# EAGLE design Side (EAGLE 9.1.3)
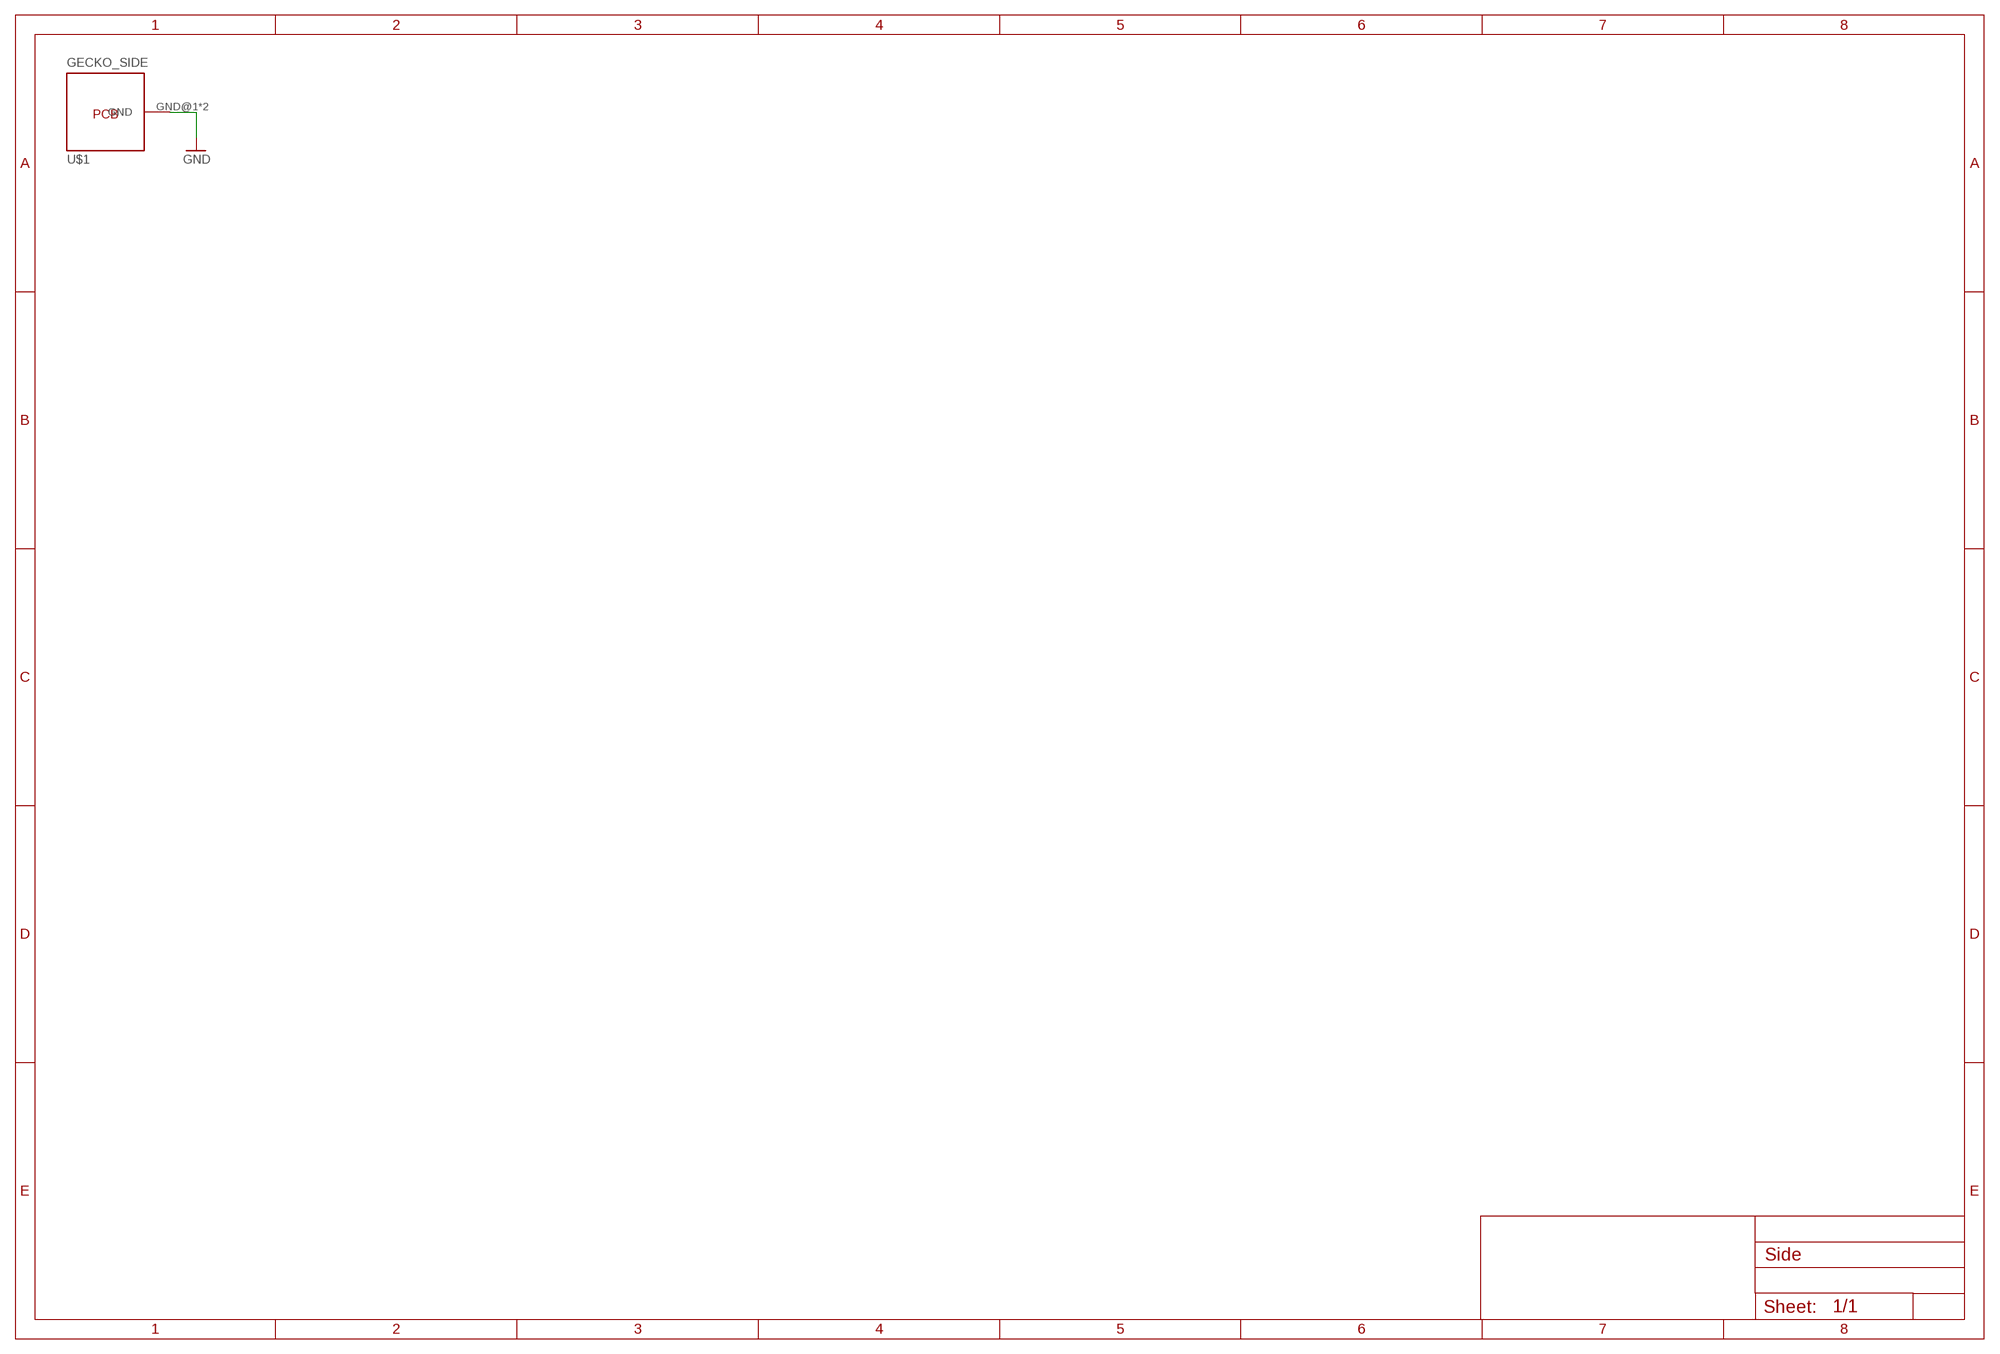
[diagram p0: schematic, sheet 1]

## Parts
U$1  GECKO_SIDE  [GECKO_SIDE]

## Nets
GND: U$1.GND@1(GND) U$1.GND@2(GND)

## Library data of the parts
U$1 = MyLib:GECKO_SIDE

## Board
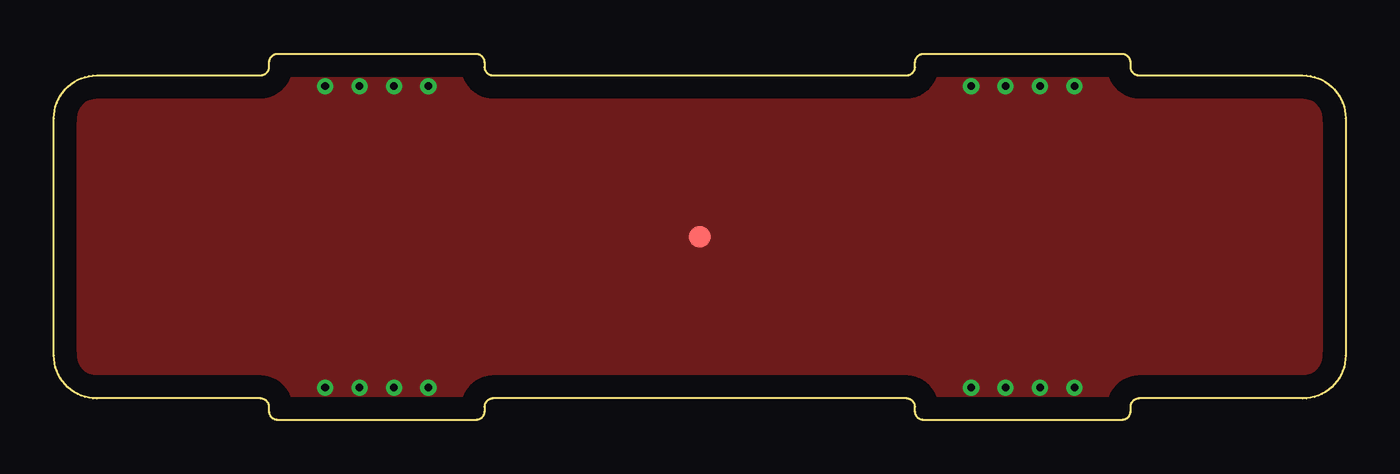
[diagram p1: board, top side]
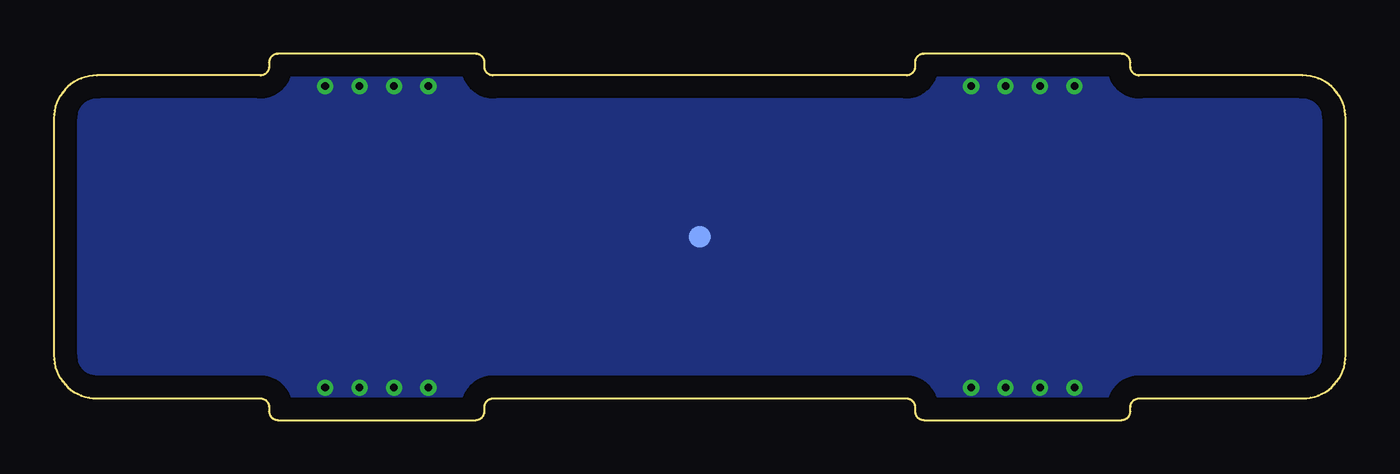
[diagram p2: board, bottom side, seen from below]

Size 60 x 17 mm. Coordinates in mm from the lower left corner, seen from the top.
Copper layers (1*16): Top 0.035mm / dielectric 1.5mm / Bottom 0.035mm
Design rules "default": minimum track width 6mil, minimum drill 0.35mm, track to track 6mil, track to pad 6mil, pad to pad 6mil, via to via 6mil, smd to smd 6mil, copper to edge 40mil, drill to drill 6mil, minimum pad ring 10mil, minimum via ring 8mil, stop-mask expansion 4mil, vias tented up to drill 0mil, thermal gap 10mil

### Footprints (pad centres in the part's own frame; a part is rotated, then mirrored left to right if it is on the bottom)
GECKO_SIDE = smd 1 x 1: GND@1 0,0 | smd 1 x 1 bottom: GND@2 0,0

### Placement (x,y rotation side)
U$1  30,8.5 0 top

### Tracks (layer width: path | path; a pad name or v marks a point on that pad's centre or on a via)
GND  (via drill 0.35)
  other vias: 12.6,15.5 14.2,15.5 15.8,15.5 17.4,15.5 12.6,1.5 14.2,1.5 15.8,1.5 17.4,1.5 42.6,15.5 44.2,15.5 45.8,15.5 47.4,15.5 42.6,1.5 44.2,1.5 45.8,1.5 47.4,1.5
  pour Bottom (no thermals): -0.5,17.5 60.5,17.5 60.5,-0.5 -0.5,-0.5
  pour Top (no thermals): -0.5,17.5 60.5,17.5 60.5,-0.5 -0.5,-0.5